# Altium schematic sheet OUTR.SchDoc
size A4
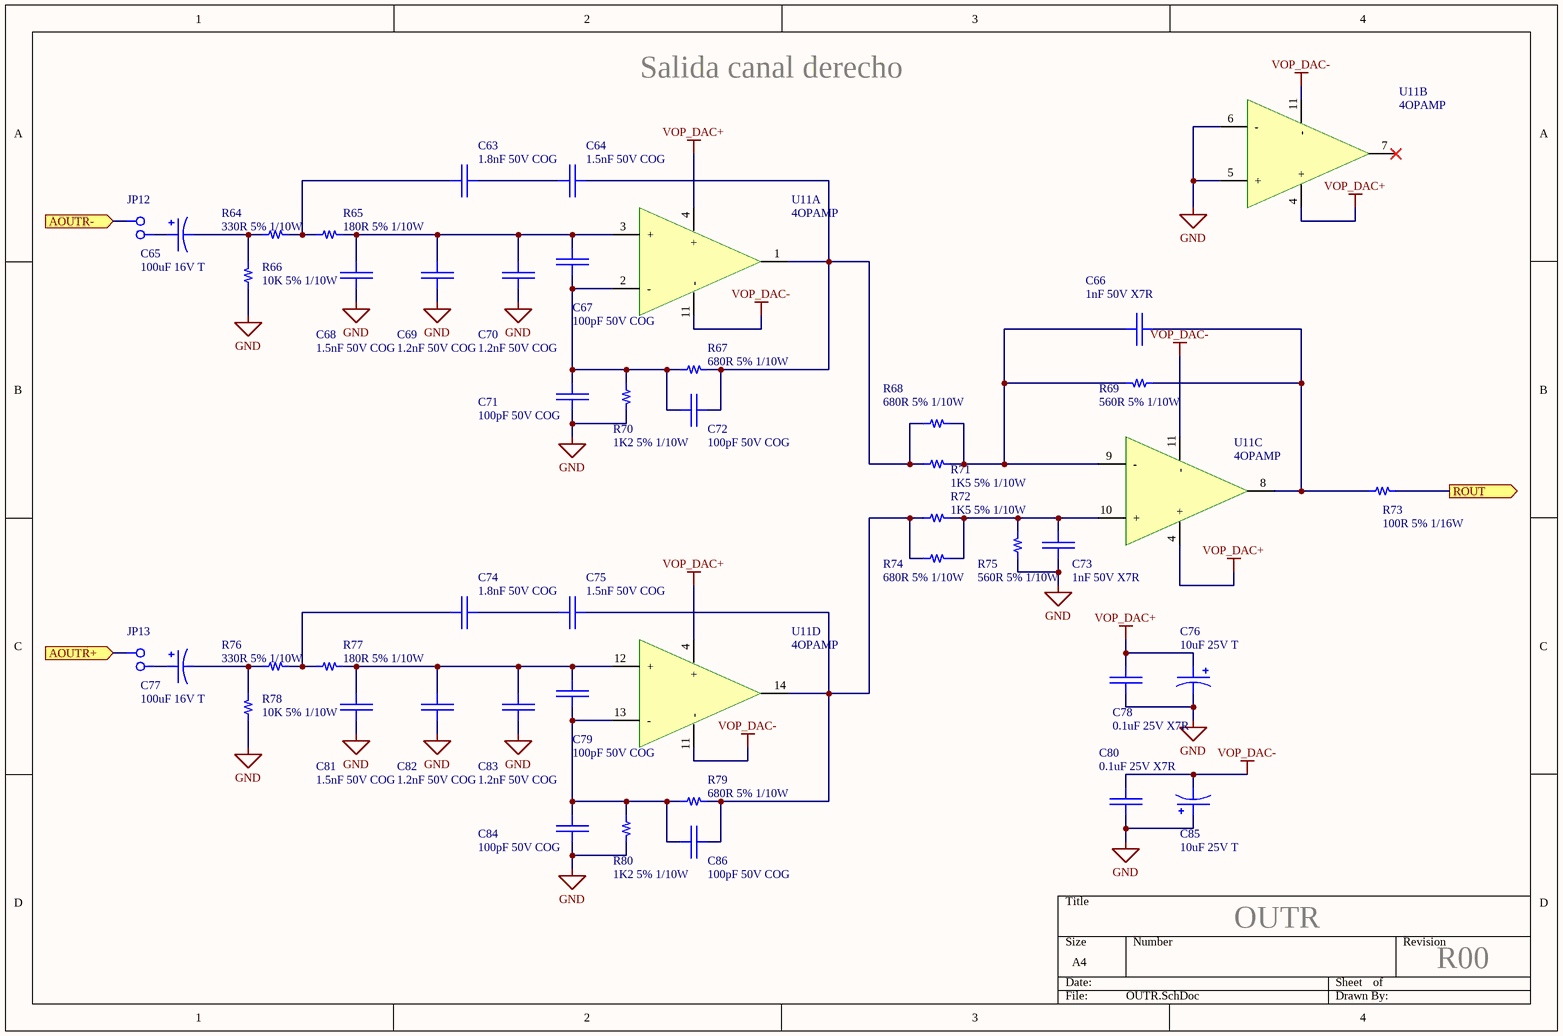
[diagram p0: OUTR.SchDoc]

## Parts
C63  1.8nF 50V COG  [C_0805]
C64  1.5nF 50V COG  [C_0805]
C65  100uF 16V T  [TANT]
C66  1nF 50V X7R  [C_0805]
C67  100pF 50V COG  [C_0805]
C68  1.5nF 50V COG  [C_0805]
C69  1.2nF 50V COG  [C_0805]
C70  1.2nF 50V COG  [C_0805]
C71  100pF 50V COG  [C_0805]
C72  100pF 50V COG  [C_0805]
C73  1nF 50V X7R  [C_0805]
C74  1.8nF 50V COG  [C_0805]
C75  1.5nF 50V COG  [C_0805]
C76  10uF 25V T  [TANT]
C77  100uF 16V T  [TANT]
C78  0.1uF 25V X7R  [C_0805]
C79  100pF 50V COG  [C_0805]
C80  0.1uF 25V X7R  [C_0805]
C81  1.5nF 50V COG  [C_0805]
C82  1.2nF 50V COG  [C_0805]
C83  1.2nF 50V COG  [C_0805]
C84  100pF 50V COG  [C_0805]
C85  10uF 25V T  [TANT]
C86  100pF 50V COG  [C_0805]
JP12  Jumper 2x1  [Conn_2_1]  (value not drawn)
JP13  Jumper 2x1  [Conn_2_1]  (value not drawn)
R64  330R 5% 1/10W  [R_0805]
R65  180R 5% 1/10W  [R_0805]
R66  10K 5% 1/10W  [R_0805]
R67  680R 5% 1/10W  [R_0805]
R68  680R 5% 1/10W  [R_0805]
R69  560R 5% 1/10W  [R_0805]
R70  1K2 5% 1/10W  [R_0805]
R71  1K5 5% 1/10W  [R_0805]
R72  1K5 5% 1/10W  [R_0805]
R73  100R 5% 1/16W  [R_0805]
R74  680R 5% 1/10W  [R_0805]
R75  560R 5% 1/10W  [R_0805]
R76  330R 5% 1/10W  [R_0805]
R77  180R 5% 1/10W  [R_0805]
R78  10K 5% 1/10W  [R_0805]
R79  680R 5% 1/10W  [R_0805]
R80  1K2 5% 1/10W  [R_0805]
U11  4OPAMP  [SOIC14]  (parts A,B,C,D of 4)

## Ports
AOUTR+ (in), AOUTR- (in), ROUT (out)

## Nets
GND: C68.1 C69.1 C70.1 C71.2 C73.2 C76.2 C78.2 C80.2 C81.1 C82.1 C83.1 C84.2 C85.1 R66.1 R70.2 R75.1 R78.1 R80.2 U11.5(+) U11.6(-)
VOP_DAC+: C76.1 C78.1 U11.4(+)
VOP_DAC-: C80.1 C85.2 U11.11(-)
AOUTR+: JP13.1 ; port AOUTR+
AOUTR-: JP12.1 ; port AOUTR-
ROUT: R73.2 ; port ROUT
NetC63_1: C63.1 C64.2
NetC63_2: C63.2 R64.2 R65.1
NetC64_1: C64.1 C72.2 R67.2 R68.1 R71.1 U11.1(OUT)
NetC65_1: C65.1 JP12.2
NetC65_2: C65.2 R64.1 R66.2
NetC66_1: C66.1 R68.2 R69.2 R71.2 U11.9(-)
NetC66_2: C66.2 R69.1 R73.1 U11.8(OUT)
NetC67_1: C67.1 C68.2 C69.2 C70.2 R65.2 U11.3(+)
NetC67_2: C67.2 C71.1 C72.1 R67.1 R70.1 U11.2(-)
NetC73_1: C73.1 R72.2 R74.2 R75.2 U11.10(+)
NetC74_1: C74.1 C75.2
NetC74_2: C74.2 R76.2 R77.1
NetC75_1: C75.1 C86.2 R72.1 R74.1 R79.2 U11.14(OUT)
NetC77_1: C77.1 JP13.2
NetC77_2: C77.2 R76.1 R78.2
NetC79_1: C79.1 C81.2 C82.2 C83.2 R77.2 U11.12(+)
NetC79_2: C79.2 C84.1 C86.1 R79.1 R80.1 U11.13(-)

Not connected (* = marked no-connect by the designer): U11 7(OUT)*

## Notes on the sheet
- Salida canal derecho
- OUTR
- R00

## Library data of the parts
C63 C64 C68-C70 C74 C75 C81-C83 = Capacitor: Capacitor de placas paralelas; Encapsulado: 0805; Cod. Proveedor: -; Proveedor: -
C65 C76 C77 C85 = CapaPol: Capacitor polarizado; Encapsulado: TH; Cod. Proveedor: -; Proveedor: -
C66 C73 = Capacitor: Capacitor de placas paralelas; Cod. Proveedor: CA3289020; Encapsulado: 0603; Proveedor: Elemon
C67 C71 C72 C79 C84 C86 = Capacitor: Capacitor de placas paralelas; Cod. Proveedor: CA3288850; Encapsulado: 0603; Proveedor: Elemon
C78 C80 = Capacitor: Capacitor de placas paralelas; Cod. Proveedor: CA3289100; Encapsulado: 0603; Proveedor: Elemon
R64 R76 = Resistor: Resistencia; Cod. Proveedor: RS3896155; Encapsulado: 0805; Proveedor: Elemon
R65 R77 = Resistor: Resistencia; Cod. Proveedor: RS3896140; Encapsulado: 0805; Proveedor: Elemon
R66-R68 R70-R72 R74 R78-R80 = Resistor: Resistencia; Encapsulado: 0805; Cod. Proveedor: -; Proveedor: -
R69 R75 = Resistor: Resistencia; Cod. Proveedor: RS3896170; Encapsulado: 0805; Proveedor: Elemon
R73 = Resistor: Resistencia; Cod. Proveedor: RS3866125; Encapsulado: 0603; Proveedor: Elemon
U11 = 4OPAMP: Integrado con 4 operacionales